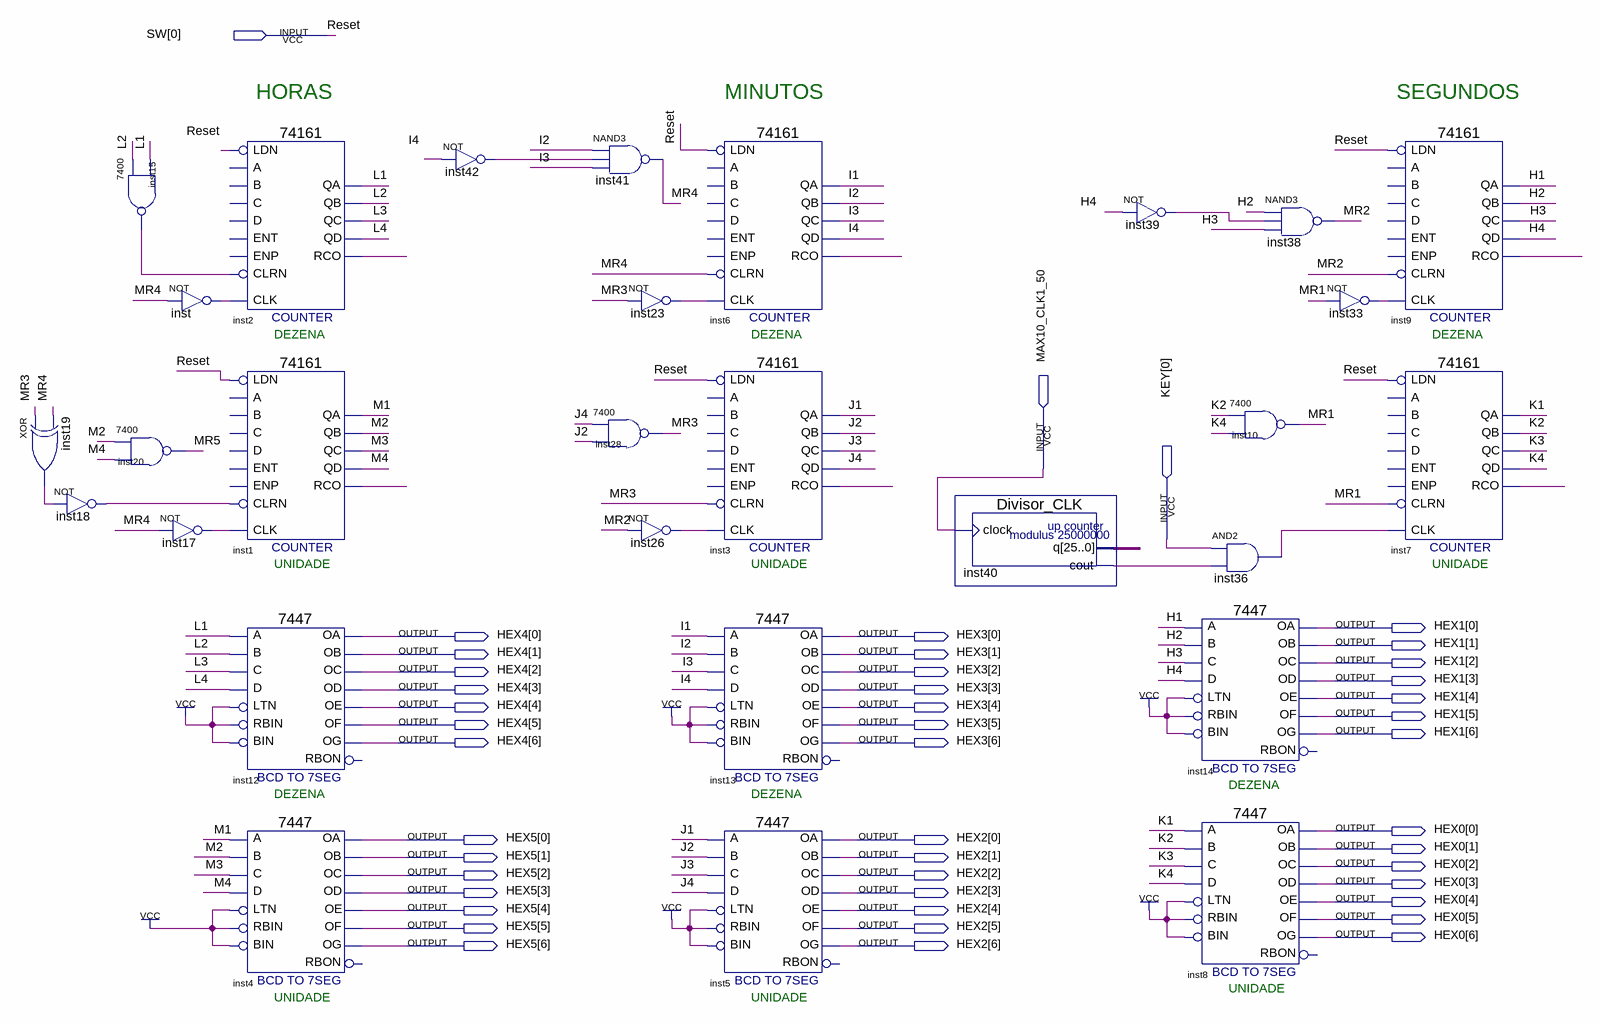
[diagram p0: schematic sheet]
// Quartus schematic prj1.bdf as structural Verilog: 29 symbols, 45 pins
module prj1 (
  input  [0:0] SW,
  input  MAX10_CLK1_50,
  input  [0:0] KEY,
  output [6:0] HEX1,
  output [6:0] HEX4,
  output [6:0] HEX3,
  output [6:0] HEX0,
  output [6:0] HEX5,
  output [6:0] HEX2
);

  wire H1, H2, H3, H4, I1, I2, I3, I4, inst1_rco, inst2_rco, inst3_rco, inst6_rco, inst7_rco, inst9_rco,
       inst15_1, inst17_out, inst18_out, inst19_out, inst23_out, inst26_out, inst33_out, inst36_out,
       inst39_out, inst40_cout, inst42_out, inst_out, J1, J2, J3, J4, K1, K2, K3, K4, L1, L2, L3, L4, M1, M2,
       M3, M4, MR1, MR2, MR3, MR4, MR5;
  wire [25:0] inst40_q;

  xor inst19 (inst19_out, MR3, MR4);
  not inst18 (inst18_out, inst19_out);
  \7400  inst15 (.\3 (L1), .\2 (L2), .\1 (inst15_1));
  \7400  inst20 (.\3 (M4), .\2 (M2), .\1 (MR5));
  not inst17 (inst17_out, MR4);
  \74161  inst2 (
    .CLRN(inst15_1), .CLK(inst_out), .LDN(SW[0]), .QD(L4), .QC(L3), .QB(L2), .QA(L1), .RCO(inst2_rco));  // open: ENP, A, D, ENT, B, C
  not inst (inst_out, MR4);
  \74161  inst1 (
    .CLRN(inst18_out), .CLK(inst17_out), .LDN(SW[0]), .QD(M4), .QC(M3), .QB(M2), .QA(M1), .RCO(inst1_rco));  // open: ENP, A, D, ENT, B, C
  \7447  inst12 (
    .LTN(1'b1), .B(L2), .C(L3), .D(L4), .RBIN(1'b1), .BIN(1'b1), .A(L1), .OB(HEX4[1]), .OC(HEX4[2]),
    .OE(HEX4[4]), .OD(HEX4[3]), .OF(HEX4[5]), .OG(HEX4[6]), .OA(HEX4[0]));  // open: RBON
  \7447  inst4 (
    .LTN(1'b1), .B(M2), .C(M3), .D(M4), .RBIN(1'b1), .BIN(1'b1), .A(M1), .OB(HEX5[1]), .OC(HEX5[2]),
    .OE(HEX5[4]), .OD(HEX5[3]), .OF(HEX5[5]), .OG(HEX5[6]), .OA(HEX5[0]));  // open: RBON
  not inst42 (inst42_out, I4);
  nand inst41 (MR4, I2, inst42_out, I3);
  not inst23 (inst23_out, MR3);
  \7400  inst28 (.\3 (J2), .\2 (J4), .\1 (MR3));
  not inst26 (inst26_out, MR2);
  \74161  inst6 (
    .CLRN(MR4), .CLK(inst23_out), .LDN(SW[0]), .QD(I4), .QC(I3), .QB(I2), .QA(I1), .RCO(inst6_rco));  // open: ENP, A, D, ENT, B, C
  \74161  inst3 (
    .CLRN(MR3), .CLK(inst26_out), .LDN(SW[0]), .QD(J4), .QC(J3), .QB(J2), .QA(J1), .RCO(inst3_rco));  // open: ENP, A, D, ENT, B, C
  \7447  inst13 (
    .LTN(1'b1), .B(I2), .C(I3), .D(I4), .RBIN(1'b1), .BIN(1'b1), .A(I1), .OB(HEX3[1]), .OC(HEX3[2]),
    .OE(HEX3[4]), .OD(HEX3[3]), .OF(HEX3[5]), .OG(HEX3[6]), .OA(HEX3[0]));  // open: RBON
  \7447  inst5 (
    .LTN(1'b1), .B(J2), .C(J3), .D(J4), .RBIN(1'b1), .BIN(1'b1), .A(J1), .OB(HEX2[1]), .OC(HEX2[2]),
    .OE(HEX2[4]), .OD(HEX2[3]), .OF(HEX2[5]), .OG(HEX2[6]), .OA(HEX2[0]));  // open: RBON
  Divisor_CLK inst40 (.clock(MAX10_CLK1_50), .cout(inst40_cout), .q(inst40_q));
  not inst39 (inst39_out, H4);
  and inst36 (inst36_out, KEY[0], inst40_cout);
  \7447  inst14 (
    .LTN(1'b1), .B(H2), .C(H3), .D(H4), .RBIN(1'b1), .BIN(1'b1), .A(H1), .OB(HEX1[1]), .OC(HEX1[2]),
    .OE(HEX1[4]), .OD(HEX1[3]), .OF(HEX1[5]), .OG(HEX1[6]), .OA(HEX1[0]));  // open: RBON
  \7447  inst8 (
    .LTN(1'b1), .B(K2), .C(K3), .D(K4), .RBIN(1'b1), .BIN(1'b1), .A(K1), .OB(HEX0[1]), .OC(HEX0[2]),
    .OE(HEX0[4]), .OD(HEX0[3]), .OF(HEX0[5]), .OG(HEX0[6]), .OA(HEX0[0]));  // open: RBON
  nand inst38 (MR2, H2, inst39_out, H3);
  \7400  inst10 (.\3 (K4), .\2 (K2), .\1 (MR1));
  not inst33 (inst33_out, MR1);
  \74161  inst9 (
    .CLRN(MR2), .CLK(inst33_out), .LDN(SW[0]), .QD(H4), .QC(H3), .QB(H2), .QA(H1), .RCO(inst9_rco));  // open: ENP, A, D, ENT, B, C
  \74161  inst7 (
    .CLRN(MR1), .CLK(inst36_out), .LDN(SW[0]), .QD(K4), .QC(K3), .QB(K2), .QA(K1), .RCO(inst7_rco));  // open: ENP, A, D, ENT, B, C

  // Other names for the same wires on the sheet: Reset = SW[0]

  // Notes on the sheet:
  //   HORAS
  //   MINUTOS
  //   SEGUNDOS
  //   DEZENA
  //   DEZENA
  //   DEZENA
  //   UNIDADE
  //   UNIDADE
  //   UNIDADE
  //   DEZENA
  //   DEZENA
  //   DEZENA
  //   UNIDADE
  //   UNIDADE
  //   UNIDADE
endmodule
